# Altium schematic sheet 07-ModuleControls.SchDoc
size A
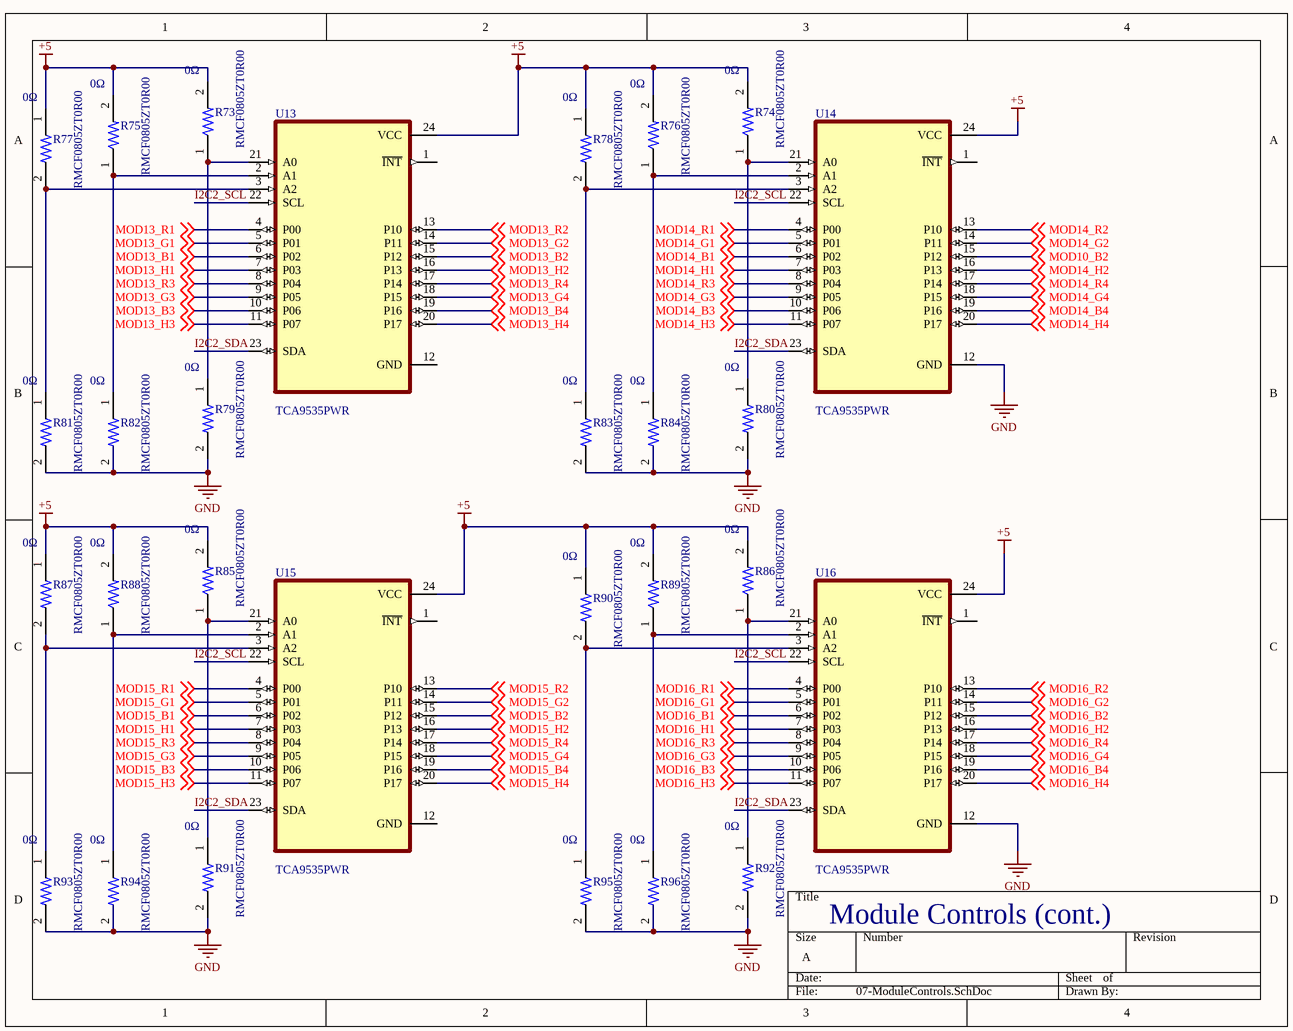
[diagram p0: 07-ModuleControls.SchDoc]

## Parts
R73  RMCF0805ZT0R00  Resitance: 0Ω  [RESC2012X60N]
R74  RMCF0805ZT0R00  Resitance: 0Ω  [RESC2012X60N]
R75  RMCF0805ZT0R00  Resitance: 0Ω  [RESC2012X60N]
R76  RMCF0805ZT0R00  Resitance: 0Ω  [RESC2012X60N]
R77  RMCF0805ZT0R00  Resitance: 0Ω  [RESC2012X60N]
R78  RMCF0805ZT0R00  Resitance: 0Ω  [RESC2012X60N]
R79  RMCF0805ZT0R00  Resitance: 0Ω  [RESC2012X60N]
R80  RMCF0805ZT0R00  Resitance: 0Ω  [RESC2012X60N]
R81  RMCF0805ZT0R00  Resitance: 0Ω  [RESC2012X60N]
R82  RMCF0805ZT0R00  Resitance: 0Ω  [RESC2012X60N]
R83  RMCF0805ZT0R00  Resitance: 0Ω  [RESC2012X60N]
R84  RMCF0805ZT0R00  Resitance: 0Ω  [RESC2012X60N]
R85  RMCF0805ZT0R00  Resitance: 0Ω  [RESC2012X60N]
R86  RMCF0805ZT0R00  Resitance: 0Ω  [RESC2012X60N]
R87  RMCF0805ZT0R00  Resitance: 0Ω  [RESC2012X60N]
R88  RMCF0805ZT0R00  Resitance: 0Ω  [RESC2012X60N]
R89  RMCF0805ZT0R00  Resitance: 0Ω  [RESC2012X60N]
R90  RMCF0805ZT0R00  Resitance: 0Ω  [RESC2012X60N]
R91  RMCF0805ZT0R00  Resitance: 0Ω  [RESC2012X60N]
R92  RMCF0805ZT0R00  Resitance: 0Ω  [RESC2012X60N]
R93  RMCF0805ZT0R00  Resitance: 0Ω  [RESC2012X60N]
R94  RMCF0805ZT0R00  Resitance: 0Ω  [RESC2012X60N]
R95  RMCF0805ZT0R00  Resitance: 0Ω  [RESC2012X60N]
R96  RMCF0805ZT0R00  Resitance: 0Ω  [RESC2012X60N]
U13  TCA9535PWR  [SOP65P640X120-24N]
U14  TCA9535PWR  [SOP65P640X120-24N]
U15  TCA9535PWR  [SOP65P640X120-24N]
U16  TCA9535PWR  [SOP65P640X120-24N]

## Nets
+5: R73.2 R74.2 R75.2 R76.2 R77.1 R78.1 R85.2 R86.2 R87.1 R88.2 R89.2 R90.1 U13.24(VCC) U14.24(VCC) U15.24(VCC) U16.24(VCC)
GND: R79.2 R80.2 R81.2 R82.2 R83.2 R84.2 R91.2 R92.2 R93.2 R94.2 R95.2 R96.2 U14.12(GND) U16.12(GND)
I2C2_SCL: U13.22(SCL) U14.22(SCL) U15.22(SCL) U16.22(SCL)
I2C2_SDA: U13.23(SDA) U14.23(SDA) U15.23(SDA) U16.23(SDA)
MOD10_B2: U14.15(P12) ; off-sheet MOD10_B2
MOD13_B1: U13.6(P02) ; off-sheet MOD13_B1
MOD13_B2: U13.15(P12) ; off-sheet MOD13_B2
MOD13_B3: U13.10(P06) ; off-sheet MOD13_B3
MOD13_B4: U13.19(P16) ; off-sheet MOD13_B4
MOD13_G1: U13.5(P01) ; off-sheet MOD13_G1
MOD13_G2: U13.14(P11) ; off-sheet MOD13_G2
MOD13_G3: U13.9(P05) ; off-sheet MOD13_G3
MOD13_G4: U13.18(P15) ; off-sheet MOD13_G4
MOD13_H1: U13.7(P03) ; off-sheet MOD13_H1
MOD13_H2: U13.16(P13) ; off-sheet MOD13_H2
MOD13_H3: U13.11(P07) ; off-sheet MOD13_H3
MOD13_H4: U13.20(P17) ; off-sheet MOD13_H4
MOD13_R1: U13.4(P00) ; off-sheet MOD13_R1
MOD13_R2: U13.13(P10) ; off-sheet MOD13_R2
MOD13_R3: U13.8(P04) ; off-sheet MOD13_R3
MOD13_R4: U13.17(P14) ; off-sheet MOD13_R4
MOD14_B1: U14.6(P02) ; off-sheet MOD14_B1
MOD14_B3: U14.10(P06) ; off-sheet MOD14_B3
MOD14_B4: U14.19(P16) ; off-sheet MOD14_B4
MOD14_G1: U14.5(P01) ; off-sheet MOD14_G1
MOD14_G2: U14.14(P11) ; off-sheet MOD14_G2
MOD14_G3: U14.9(P05) ; off-sheet MOD14_G3
MOD14_G4: U14.18(P15) ; off-sheet MOD14_G4
MOD14_H1: U14.7(P03) ; off-sheet MOD14_H1
MOD14_H2: U14.16(P13) ; off-sheet MOD14_H2
MOD14_H3: U14.11(P07) ; off-sheet MOD14_H3
MOD14_H4: U14.20(P17) ; off-sheet MOD14_H4
MOD14_R1: U14.4(P00) ; off-sheet MOD14_R1
MOD14_R2: U14.13(P10) ; off-sheet MOD14_R2
MOD14_R3: U14.8(P04) ; off-sheet MOD14_R3
MOD14_R4: U14.17(P14) ; off-sheet MOD14_R4
MOD15_B1: U15.6(P02) ; off-sheet MOD15_B1
MOD15_B2: U15.15(P12) ; off-sheet MOD15_B2
MOD15_B3: U15.10(P06) ; off-sheet MOD15_B3
MOD15_B4: U15.19(P16) ; off-sheet MOD15_B4
MOD15_G1: U15.5(P01) ; off-sheet MOD15_G1
MOD15_G2: U15.14(P11) ; off-sheet MOD15_G2
MOD15_G3: U15.9(P05) ; off-sheet MOD15_G3
MOD15_G4: U15.18(P15) ; off-sheet MOD15_G4
MOD15_H1: U15.7(P03) ; off-sheet MOD15_H1
MOD15_H2: U15.16(P13) ; off-sheet MOD15_H2
MOD15_H3: U15.11(P07) ; off-sheet MOD15_H3
MOD15_H4: U15.20(P17) ; off-sheet MOD15_H4
MOD15_R1: U15.4(P00) ; off-sheet MOD15_R1
MOD15_R2: U15.13(P10) ; off-sheet MOD15_R2
MOD15_R3: U15.8(P04) ; off-sheet MOD15_R3
MOD15_R4: U15.17(P14) ; off-sheet MOD15_R4
MOD16_B1: U16.6(P02) ; off-sheet MOD16_B1
MOD16_B2: U16.15(P12) ; off-sheet MOD16_B2
MOD16_B3: U16.10(P06) ; off-sheet MOD16_B3
MOD16_B4: U16.19(P16) ; off-sheet MOD16_B4
MOD16_G1: U16.5(P01) ; off-sheet MOD16_G1
MOD16_G2: U16.14(P11) ; off-sheet MOD16_G2
MOD16_G3: U16.9(P05) ; off-sheet MOD16_G3
MOD16_G4: U16.18(P15) ; off-sheet MOD16_G4
MOD16_H1: U16.7(P03) ; off-sheet MOD16_H1
MOD16_H2: U16.16(P13) ; off-sheet MOD16_H2
MOD16_H3: U16.11(P07) ; off-sheet MOD16_H3
MOD16_H4: U16.20(P17) ; off-sheet MOD16_H4
MOD16_R1: U16.4(P00) ; off-sheet MOD16_R1
MOD16_R2: U16.13(P10) ; off-sheet MOD16_R2
MOD16_R3: U16.8(P04) ; off-sheet MOD16_R3
MOD16_R4: U16.17(P14) ; off-sheet MOD16_R4
NetR73_1: R73.1 R79.1 U13.21(A0)
NetR74_1: R74.1 R80.1 U14.21(A0)
NetR75_1: R75.1 R82.1 U13.2(A1)
NetR76_1: R76.1 R84.1 U14.2(A1)
NetR77_2: R77.2 R81.1 U13.3(A2)
NetR78_2: R78.2 R83.1 U14.3(A2)
NetR85_1: R85.1 R91.1 U15.21(A0)
NetR86_1: R86.1 R92.1 U16.21(A0)
NetR87_2: R87.2 R93.1 U15.3(A2)
NetR88_1: R88.1 R94.1 U15.2(A1)
NetR89_1: R89.1 R96.1 U16.2(A1)
NetR90_2: R90.2 R95.1 U16.3(A2)

Not connected (* = marked no-connect by the designer): U13 1(~{INT}) 12(GND); U14 1(~{INT}); U15 1(~{INT}) 12(GND); U16 1(~{INT})

## Notes on the sheet
- Module Controls (cont.)

## Library data of the parts
R73-R96 = RMCF0805ZT0R00: 0 Ohms Jumper 0.125W, 1/8W Chip Resistor 0805 (2012 Metric) Automotive AEC-Q200 Thick Film; MF: Stackpole Electronics; DigiKey-Purchase-URL: https://snapeda.com/shop?store=DigiKey&id=492501; Package: 0805 Stackpole Electronics; Availability: Unavailable; MP: RMCF0805ZT0R00; SnapEDA_Link: https://www.snapeda.com/parts/RMCF0805ZT0R00/Stackpole%20Electronics%20Inc/view-part/492501/?ref=snap; Price: None; Parameter 1: *
U13-U16 = TCA9535PWR: Remote 16-Bit I2C and SMBus, Low-Power I/O Expander With Interrupt Output and Config Registers 24-TSSOP -40 to 85; MF: Texas Instruments; Texas_Instruments-Purchase-URL: https://snapeda.com/shop?store=Texas+Instruments&id=1237891; SnapEDA_Link: https://www.snapeda.com/parts/TCA9535PWR/Texas%20Instruments/view-part/1237891/?ref=snap; Availability: Good; Price: None; MP: TCA9535PWR; DigiKey-Purchase-URL: https://snapeda.com/shop?store=DigiKey&id=1237891; Package: TSSOP-24 Texas Instruments; Mouser-Purchase-URL: https://snapeda.com/shop?store=Mouser&id=1237891; Arrow_Electronics-Purchase-URL: https://snapeda.com/shop?store=Arrow+Electronics&id=1237891; Value: *